# Altium schematic sheet MCU.SchDoc: =DocumentName
size 297 x 209 mm; CompanyName: "AS Manufacturing" LLC; Organization: "AS Manufacturing" LLC; Address1: 5 Sklyarenka St.; Address2: Kyiv 04073; Address3: Ukraine; Address4: https://ajax.systems/en/; DocumentNumber: 7; SheetNumber: 7; SheetTotal: 7; Template_version: 1.0.1
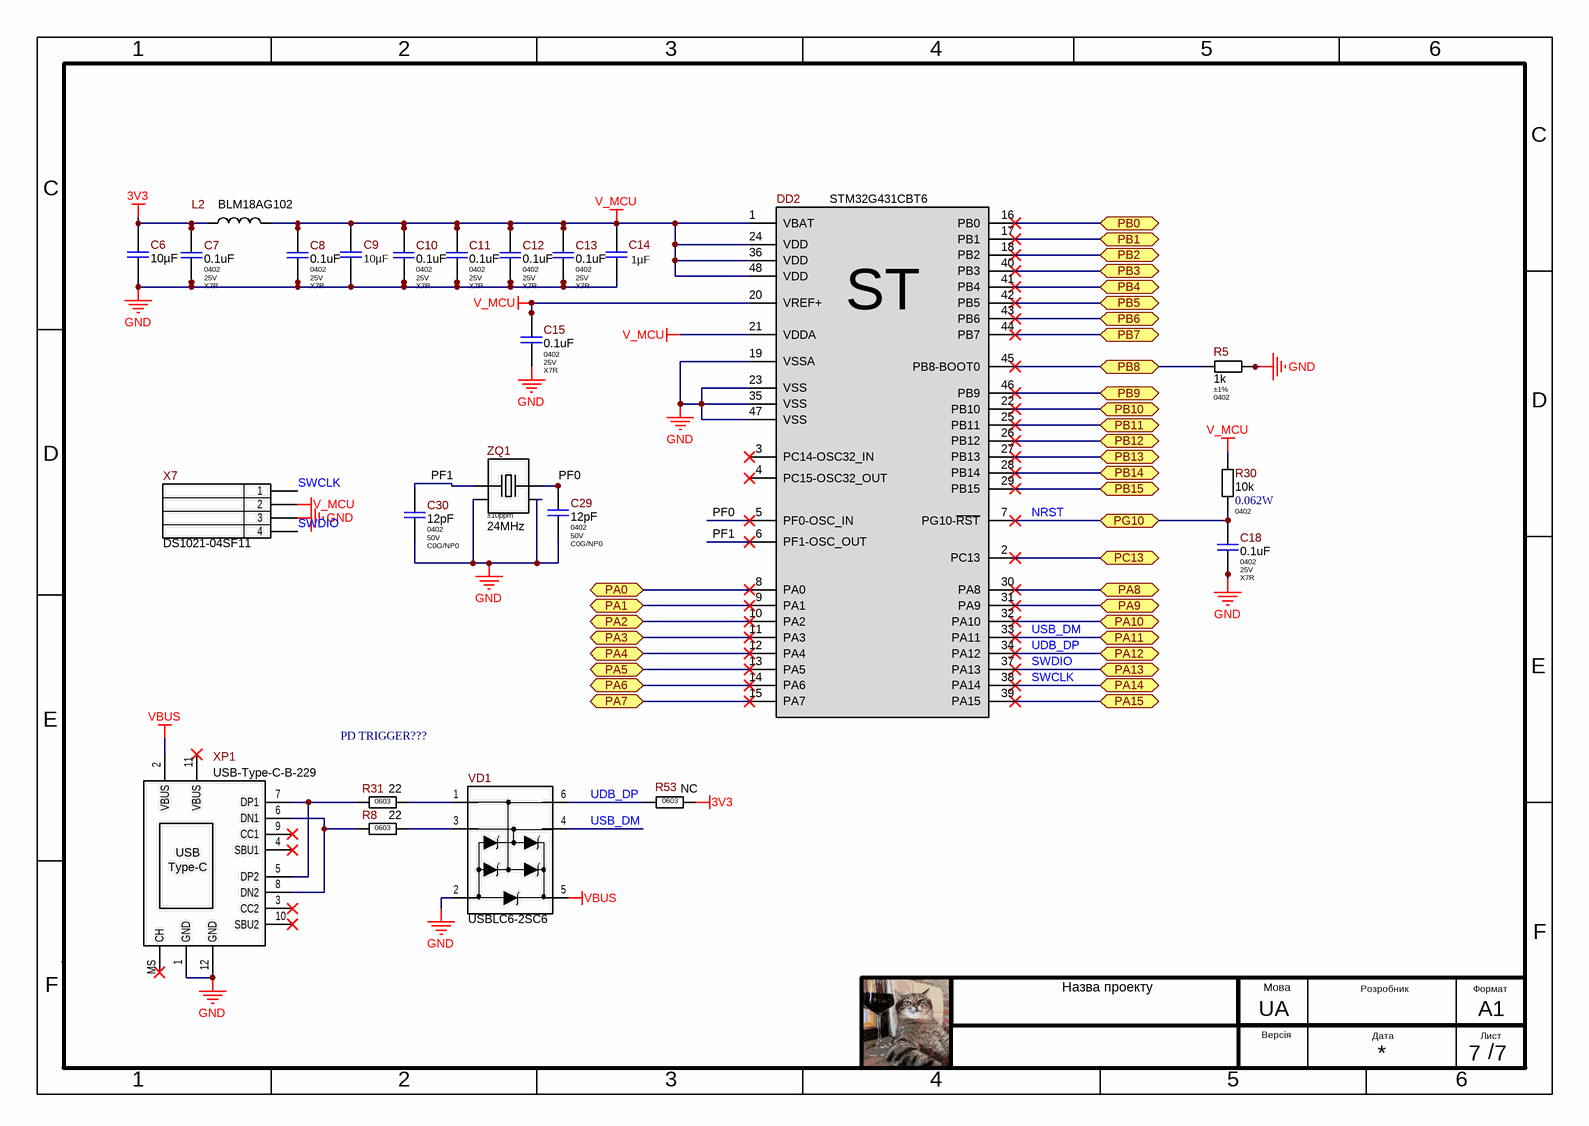
[diagram p0: MCU.SchDoc]

## Parts
C6  10µF  [C0603(1608)]
C7  0.1uF  Package: 0402  Voltage: 25V  Dielectric Type: X7R  [C_CERAMIC_0402_MED]
C8  0.1uF  Package: 0402  Voltage: 25V  Dielectric Type: X7R  [C_CERAMIC_0402_MED]
C9  10µF  [C0603(1608)]
C10  0.1uF  Package: 0402  Voltage: 25V  Dielectric Type: X7R  [C_CERAMIC_0402_MED]
C11  0.1uF  Package: 0402  Voltage: 25V  Dielectric Type: X7R  [C_CERAMIC_0402_MED]
C12  0.1uF  Package: 0402  Voltage: 25V  Dielectric Type: X7R  [C_CERAMIC_0402_MED]
C13  0.1uF  Package: 0402  Voltage: 25V  Dielectric Type: X7R  [C_CERAMIC_0402_MED]
C14  1µF  [C0603(1608)]
C15  0.1uF  Package: 0402  Voltage: 25V  Dielectric Type: X7R  [C_CERAMIC_0402_MED]
C18  0.1uF  Package: 0402  Voltage: 25V  Dielectric Type: X7R  [C_CERAMIC_0402_MED]
C29  12pF  Package: 0402  Voltage: 50V  Dielectric Type: C0G/NP0  [C_CERAMIC_0402_MED]
C30  12pF  Package: 0402  Voltage: 50V  Dielectric Type: C0G/NP0  [C_CERAMIC_0402_MED]
DD2  STM32G431CBT6  [LQFP48]
L2  BLM18AG102  [BLM18(0603)]
R5  Tolerance: ±1%  Package: 0402  [R_ANY_CHIP_0402_MED]  (hidden comment: 1k)
R8  22  Package/Case: 0603  [R0603]
R30  10k  Power Rating: 0.062W  Package: 0402  [R_ANY_CHIP_0402_MED]
R31  22  Package/Case: 0603  [R0603]
R53  Package/Case: 0603  [R0603]  (hidden comment: NC)
VD1  USBLC6-2SC6  [SOT-23-6]
X7  Part Number: DS1021-04SF11  [DS1021-04S]  (hidden comment: PLS-4 (Part of PLS-40))
XP1  USB-Type-C-B-229  [USB-Type-C-B-229]
ZQ1  Frequency Tolerance: ±10ppm  Frequency: 24MHz  [CXA-321_REC]  (hidden comment: C3E-24.000-18-1010-R)

## Ports
PA0 (bidir), PA1 (bidir), PA2 (bidir), PA3 (bidir), PA4 (bidir), PA5 (bidir), PA6 (bidir), PA7 (bidir), PA8 (bidir), PA9 (bidir), PA10 (bidir), PA11 (bidir), PA12 (bidir), PA13 (bidir), PA14 (bidir), PA15 (bidir), PB0 (bidir), PB1 (bidir), PB2 (bidir), PB3 (bidir), PB4 (bidir), PB5 (bidir), PB6 (bidir), PB7 (bidir), PB8 (bidir), PB9 (bidir), PB10 (bidir), PB11 (bidir), PB12 (bidir), PB13 (bidir), PB14 (bidir), PB15 (bidir), PC13 (bidir), PG10 (bidir)

## Nets
3V3: C6.1 C7.2 L2.1 R53.2
GND: C6.2 C7.1 C8.1 C9.2 C10.1 C11.1 C12.1 C13.1 C14.2 C15.1 C18.1 C29.2 C30.2 DD2.19(VSSA) DD2.23(VSS) DD2.35(VSS) DD2.47(VSS) R5.2 VD1.2(GND) X7.3 XP1.1(GND) XP1.12(GND) ZQ1.2(NC1) ZQ1.4(NC2)
V_MCU: C8.2 C9.1 C10.2 C11.2 C12.2 C13.2 C14.1 C15.2 DD2.1(VBAT) DD2.20(VREF+) DD2.21(VDDA) DD2.24(VDD) DD2.36(VDD) DD2.48(VDD) L2.2 R30.1 X7.2
VBUS: VD1.5(VBUS) XP1.2(VBUS)
NRST: C18.2 DD2.7(PG10-~{RST}) R30.2 ; port PG10
PA0: DD2.8(PA0) ; port PA0
PA1: DD2.9(PA1) ; port PA1
PA2: DD2.10(PA2) ; port PA2
PA3: DD2.11(PA3) ; port PA3
PA4: DD2.12(PA4) ; port PA4
PA5: DD2.13(PA5) ; port PA5
PA6: DD2.14(PA6) ; port PA6
PA7: DD2.15(PA7) ; port PA7
PA8: DD2.30(PA8) ; port PA8
PA9: DD2.31(PA9) ; port PA9
PA10: DD2.32(PA10) ; port PA10
PA15: DD2.39(PA15) ; port PA15
PB0: DD2.16(PB0) ; port PB0
PB1: DD2.17(PB1) ; port PB1
PB2: DD2.18(PB2) ; port PB2
PB3: DD2.40(PB3) ; port PB3
PB4: DD2.41(PB4) ; port PB4
PB5: DD2.42(PB5) ; port PB5
PB6: DD2.43(PB6) ; port PB6
PB7: DD2.44(PB7) ; port PB7
PB8: DD2.45(PB8-BOOT0) R5.1 ; port PB8
PB9: DD2.46(PB9) ; port PB9
PB10: DD2.22(PB10) ; port PB10
PB11: DD2.25(PB11) ; port PB11
PB12: DD2.26(PB12) ; port PB12
PB13: DD2.27(PB13) ; port PB13
PB14: DD2.28(PB14) ; port PB14
PB15: DD2.29(PB15) ; port PB15
PC13: DD2.2(PC13) ; port PC13
PF0: C29.1 DD2.5(PF0-OSC_IN) ZQ1.3(XTAL2)
PF1: C30.1 DD2.6(PF1-OSC_OUT) ZQ1.1(XTAL1)
SWCLK: DD2.38(PA14) X7.1 ; port PA14
SWDIO: DD2.37(PA13) X7.4 ; port PA13
UDB_DP: DD2.34(PA12) R53.1 VD1.6(D+OUT) ; port PA12
USB_DM: DD2.33(PA11) VD1.4(D-OUT) ; port PA11
NetR8_1: R8.1 XP1.6(DN1) XP1.8(DN2)
NetR8_2: R8.2 VD1.3(D-IN)
NetR31_1: R31.1 XP1.5(DP2) XP1.7(DP1)
NetR31_2: R31.2 VD1.1(D+IN)

Not connected (* = marked no-connect by the designer): DD2 3(PC14-OSC32_IN)* 4(PC15-OSC32_OUT)*; XP1 3(CC2)* 4(SBU1)* 9(CC1)* 10(SBU2)* 11(VBUS)* MS(CH)*

## Notes on the sheet
- PD TRIGGER???
- 1
- 2
- 3
- 4
- 5
- 6
- C
- D
- E
- F
- Назва проекту
- Мова
- UA
- Розробник
- Формат
- A1
- Версія
- Дата
- Лист
- /
- (in symbol STM32G431CBT6) ST
- (in symbol USB-Type-C-B-229) USB; Type-C

## Library data of the parts
C6 C9 = 10µF  6.3V C0603: CAP CER 10UF 6.3V X5R 0603; Manufacturer: Murata Electronics North America; Manufacturer P/N: GRM185R60J106ME15D; Name Component: Capacitor Ceramic; Tolerance: ±20%; Operation Temperature: -55°C ~ 105°C; Notes: GRM185R60J106ME15J; Library Path 1: Capacitors.SchLib; Part Number: 10µF  6.3V C0603; Value: 10µF; Temperature Coefficient: X5R; Power (V/A): 6.3V; Package/Case: C0603; Supplier 1: Digi-key; Supplier Part Number 1: 490-10467-2-ND; ComponentLink1Description: Datasheet; ComponentLink1URL: https://www.murata.com/~/media/webrenewal/support/library/catalog/products/capacitor/mlcc/c02e.ashx?la=en-us
C7 C8 C10-C13 C15 C18 = GRM155R71E104KE14J: 100nF 25V X7R ±10% 0402 Ceramic Capacitor RoHS; Manufacturer: Murata Electronics; Ajax_1C_ID: 24481; Ajax_1C_PN: 100nF 25V X7R 10% 0402 GRM155R71E104KE14J Ceramic Capacitor SMD RoHS; Ajax_1С_Status: Mass Production; Component Status: Released; Standard Lead Time: 24 Weeks; Replacement: NONE; GUID_1C: 92ffc16c-33b6-11eb-ab6e-0050569f2651; Part Number: GRM155R71E104KE14J; Value: 0.1uF; Tolerance: ±10%; ComponentLink1Description: Datasheet; ComponentLink1URL: https://eu.mouser.com/datasheet/2/281/1/GRM155R71E104KE14_01A-1984358.pdf; Part Type: Ceramic / X7R / 0402; Component Type: SMD; Temperature Range: -55°C ~ 125°C; Price: 0.00630066
C14 = 1µF  25V C0603: CAP CER 1UF 25V X5R 0603; Manufacturer: AVX Corporation; Manufacturer P/N: 06033D105KAT2A; Name Component: Capacitor Ceramic; Tolerance: ±10%; Operation Temperature: -55°C ~ 105°C; Library Path 1: Capacitors.SchLib; Part Number: 1µF  25V C0603; Value: 1µF; Temperature Coefficient: X5R; Power (V/A): 25V; Package/Case: C0603; Supplier 1: Digi-key; Supplier Part Number 1: 478-5142-2-ND; ComponentLink1Description: Datasheet; ComponentLink1URL: http://catalogs.avx.com/SurfaceMount.pdf
C29 C30 = CL05C120JB5NNNC: 12pF 50V C0G ±5% 0402 Ceramic Capacitor RoHS; Manufacturer: Samsung Electro-Mechanics; Ajax_1C_ID: 15982; Ajax_1C_PN: 12pF 50V COG 5% 0402 CL05C120JB5NNNC Ceramic Capacitor SMD RoHS; Ajax_1С_Status: Mass Production; Component Status: Released; Standard Lead Time: 28 Weeks; Replacement: NONE; GUID_1C: 5e79e13c-76f0-11e9-ab56-0050569f2651; Part Number: CL05C120JB5NNNC; Value: 12pF; Tolerance: ±5%; Supplier 1: Digi-Key; Supplier Part Number 1: 1276-1178-2-ND; ComponentLink1Description: Datasheet; ComponentLink1URL: https://media.digikey.com/pdf/Data%20Sheets/Samsung%20PDFs/CL_Series_MLCC_ds.pdf; Part Type: Ceramic / C0G(NP0) / 0402; Component Type: SMD; Temperature Range: -55°C ~ 125°C; Price: 0.0022
DD2 = STM32G431CBT6: ARM® Cortex®-M4F STM32G4 Microcontroller IC 32-Bit Single-Core 170MHz 128KB (128K x 8) FLASH 48-LQFP (7x7); MF: STMicroelectronics; MP: STM32G431CBU6; Name Component: Microcontrollers; Operation Temperature: -40°C ~ 85°C (TA); Power (V/A): 1.71V ~ 3.6V; Library Path 1: Integrated Circuit.SchLib; SnapEDA_Link: https://www.snapeda.com/parts/STM32G431CBU6/STMicroelectronics/view-part/?ref=snap; Package: UFQFPN-48 STMicroelectronics; Value: STM32G431CBT6; Check_prices: https://www.snapeda.com/parts/STM32G431CBU6/STMicroelectronics/view-part/?ref=eda; Part Number: STM32G431CBT6; Package/Case: 48-LQFP; Manufacturer: STMicroelectronics; Manufacturer P/N: STM32G431CBT6; Supplier 1: Digi-key; Supplier Part Number 1: 497-19475-ND; ComponentLink1Description: Datasheet; ComponentLink1URL: https://www.st.com/resource/en/datasheet/stm32g431cb.pdf
L2 = BLM18AG102: FERRITE BEAD 1 KOHM 0603 1LN; Manufacturer: Murata Electronics North America; Manufacturer P/N: BLM18AG102SZ1D; Name Component: Ferrite Beads; Tolerance: ±25%; Power (V/A): 400mA; Library Path 1: Inductance.SchLib; Part Number: BLM18AG102; Value: BLM18AG102; Package/Case: 0603 (1608 Metric); Supplier 1: Digi-key; Supplier Part Number 1: 490-16503-2-ND; ComponentLink1Description: Datasheet; ComponentLink1URL: https://media.digikey.com/pdf/Data%20Sheets/Murata%20PDFs/BLM18yyyyyyN1x.pdf
R5 = RC0402FR-071KL: 1 kOhms ±1% 1/16W 0402 Thick Film Resistor; Manufacturer: Yageo; Power Rating: 0.062W; Ajax_1C_ID: 4845; Ajax_1C_PN: 1k 1% 0402 Resistors SMD RoHS; Ajax_1С_Status: Mass Production; Component Status: Released; Voltage: 50V; Temperature Stability: ±100ppm/°C; Replacement: NONE; GUID_1C: bf05aaa5-08f0-11e4-b679-a45d36c4a9e5; Value: 1k; Part Number: RC0402FR-071KL; Part Type: Thick Film; Component Type: SMD; Temperature Range: -55°C ~ 155°C; ComponentLink1URL: https://eu.mouser.com/datasheet/2/447/PYu_RC_Group_51_RoHS_L_11-1984063.pdf; Supplier 1: Digi-Key; Supplier Part Number 1: 311-1.00KLRTR-ND; Price: 0.0007; ComponentLink1Description: Datasheet
R8 R31 = 22  R0603: RES SMD 22 OHM  ±1% 1/10W 0603; Name Component: Resistror; Operation Temperature: -55℃ to 155℃; Temperature Coefficient: ±100 ppm/°C; Library Path 1: Resistor.SchLib; Part Number: 22  R0603; Value: 22; Tolerance: ±1%
R30 = RC0402JR-0710KL: 10 kOhms ±5% 1/16W 0402 Thick Film Resistor; Manufacturer: Yageo; Ajax_1C_ID: 3447; Ajax_1C_PN: 10k 5% 0402 Resistors SMD RoHS; Ajax_1С_Status: Mass Production; Component Status: Released; Voltage: 50V; Temperature Stability: ±100ppm/°C; Replacement: NONE; GUID_1C: 0d073320-42e0-11e3-bb71-6c626deda1bb; Part Number: RC0402JR-0710KL; Value: 10k; Tolerance: ±5%; Part Type: Thick Film; Component Type: SMD; Temperature Range: -55°C ~ 155°C; ComponentLink1URL: https://eu.mouser.com/datasheet/2/447/PYu_RC_Group_51_RoHS_L_10-1664068.pdf; Supplier 1: Digi-Key; Supplier Part Number 1: 311-10KJRTR-ND; Price: 0.0005; ComponentLink1Description: Datasheet
R53 = 1.5 k  R0603: RES SMD 1.5 k OHM  ±1% 1/10W 0603; Power Rating: 0.1W; Name Component: Resistror; Operation Temperature: -55℃ to 155℃; Temperature Coefficient: ±100 ppm/°C; Library Path 1: Resistor.SchLib; Value: NC; Part Number: 1.5 k  R0603
VD1 = USBLC6-2SC6: TVS DIODE 5.25V 17V SOT23-6; Manufacturer: STMicroelectronics; Name Component: TVS - Diodes; Operation Temperature: -40°C ~ 125°C (TJ); Power Rating: 17V 5A; Library Path 1: Diodes.SchLib; ComponentLink1URL: https://www.st.com/resource/en/datasheet/usblc6-2.pdf; ComponentLink1Description: Datasheet; Part Number: USBLC6-2SC6; Value: USBLC6-2SC6; Package/Case: SOT-23-6; Manufacturer P/N: USBLC6-2SC6; Supplier 1: Digi-key; Supplier Part Number 1: 497-5235-2-ND
X7 = DS1021-04SF11: 4 Pin 2.54mm Male Header, Vertical, 3mm and 6.1mm, PLS-4; Manufacturer: Connfly; Ajax_1C_ID: 1215; Ajax_1C_PN: PLS40, планки зі штирьками; Ajax_1С_Status: Mass Production; Component Status: Released; Replacement: NONE; GUID_1C: 10be163c-dd40-11e0-af93-6c626deda1bb; Part Type: Header / Male Pin / Single Row; Component Type: PTH; Temperature Range: -40°C ~ 105°C; ComponentLink1URL: \\altiumdb.ajax.local\files\Datasheet\Connectors\DS1021.pdf; Price: 0.00351512; ComponentLink1Description: Datasheet
XP1 = USB-Type-C-B-229: Manufacturer: KLS ELECTRONIC CO., LTD.; Operation Temperature: -55 °C to +105 °C; Power (V/A): 3А 250В; Library Path 1: Connectors.SchLib; Part Number: USB-Type-C-B-229; Name Component: USB-Type-C; Value: USB-Type-C-B-229; Package/Case: USB-Type-C-B-229; Supplier 1: Kosmodrom; ComponentLink1Description: Datasheet; ComponentLink1URL: http://www.kosmodrom.com.ua/pdf/USB-Type-C-B-229.pdf
ZQ1 = C3E-24.000-18-1010-R: 24MHz, 18pF, ±10ppm, 100Ohm ESR, 100uW DL Crystal Quartz; Manufacturer: Aker; Ajax_1C_ID: 112658; Ajax_1C_PN: Crystal C3E-24.000-18-1010-R (CXAN-024000-3F18F00) 24MHz 10ppm 18pF 3.2x2.5mm SMD Aker Technology Corp; Ajax_1С_Status: Mass Production; Component Status: Released; Standard Lead Time: NONE; GUID_1C: 0303893b-6f74-11ef-b61c-0050569991a1; Part Number: C3E-24.000-18-1010-R; Part Type: Crystal; Component Type: SMD; Load Capacitance: 18pF; Frequency Stability: ±10ppm; Temperature Range: -10°C ~ 70 °C; ComponentLink1URL: https://aker-usa.com/files/content/products/crystals/C3E-General-Specification.pdf; Replacement: NONE; Price: 0.093; ComponentLink1Description: Datasheet